# Altium schematic sheet 01_COVER.SchDoc: Enterprise Baseboard
size A2; ApprovedBy: DNP; CheckedBy: DNP; Author: DNP; CompanyName: Google LLC; DrawnBy: DNP; Engineer: Bangfei/Michael/Leo; Organization: Google LLC; Address1: 1600 Amphitheatre Parkway; Address2: Mountain View, CA 94043; Address3: DNP; Address4: DNP; DocumentNumber: DNP; Revision: PVT; SheetNumber: 1; SheetTotal: 11; VersionControl_RevNumber: DNP; IsUserConfigurable: DNP; Time: DNP; ImagePath: DNP; Rule: DNP; ProjectName: Enterprise; Application_BuildNumber: DNP
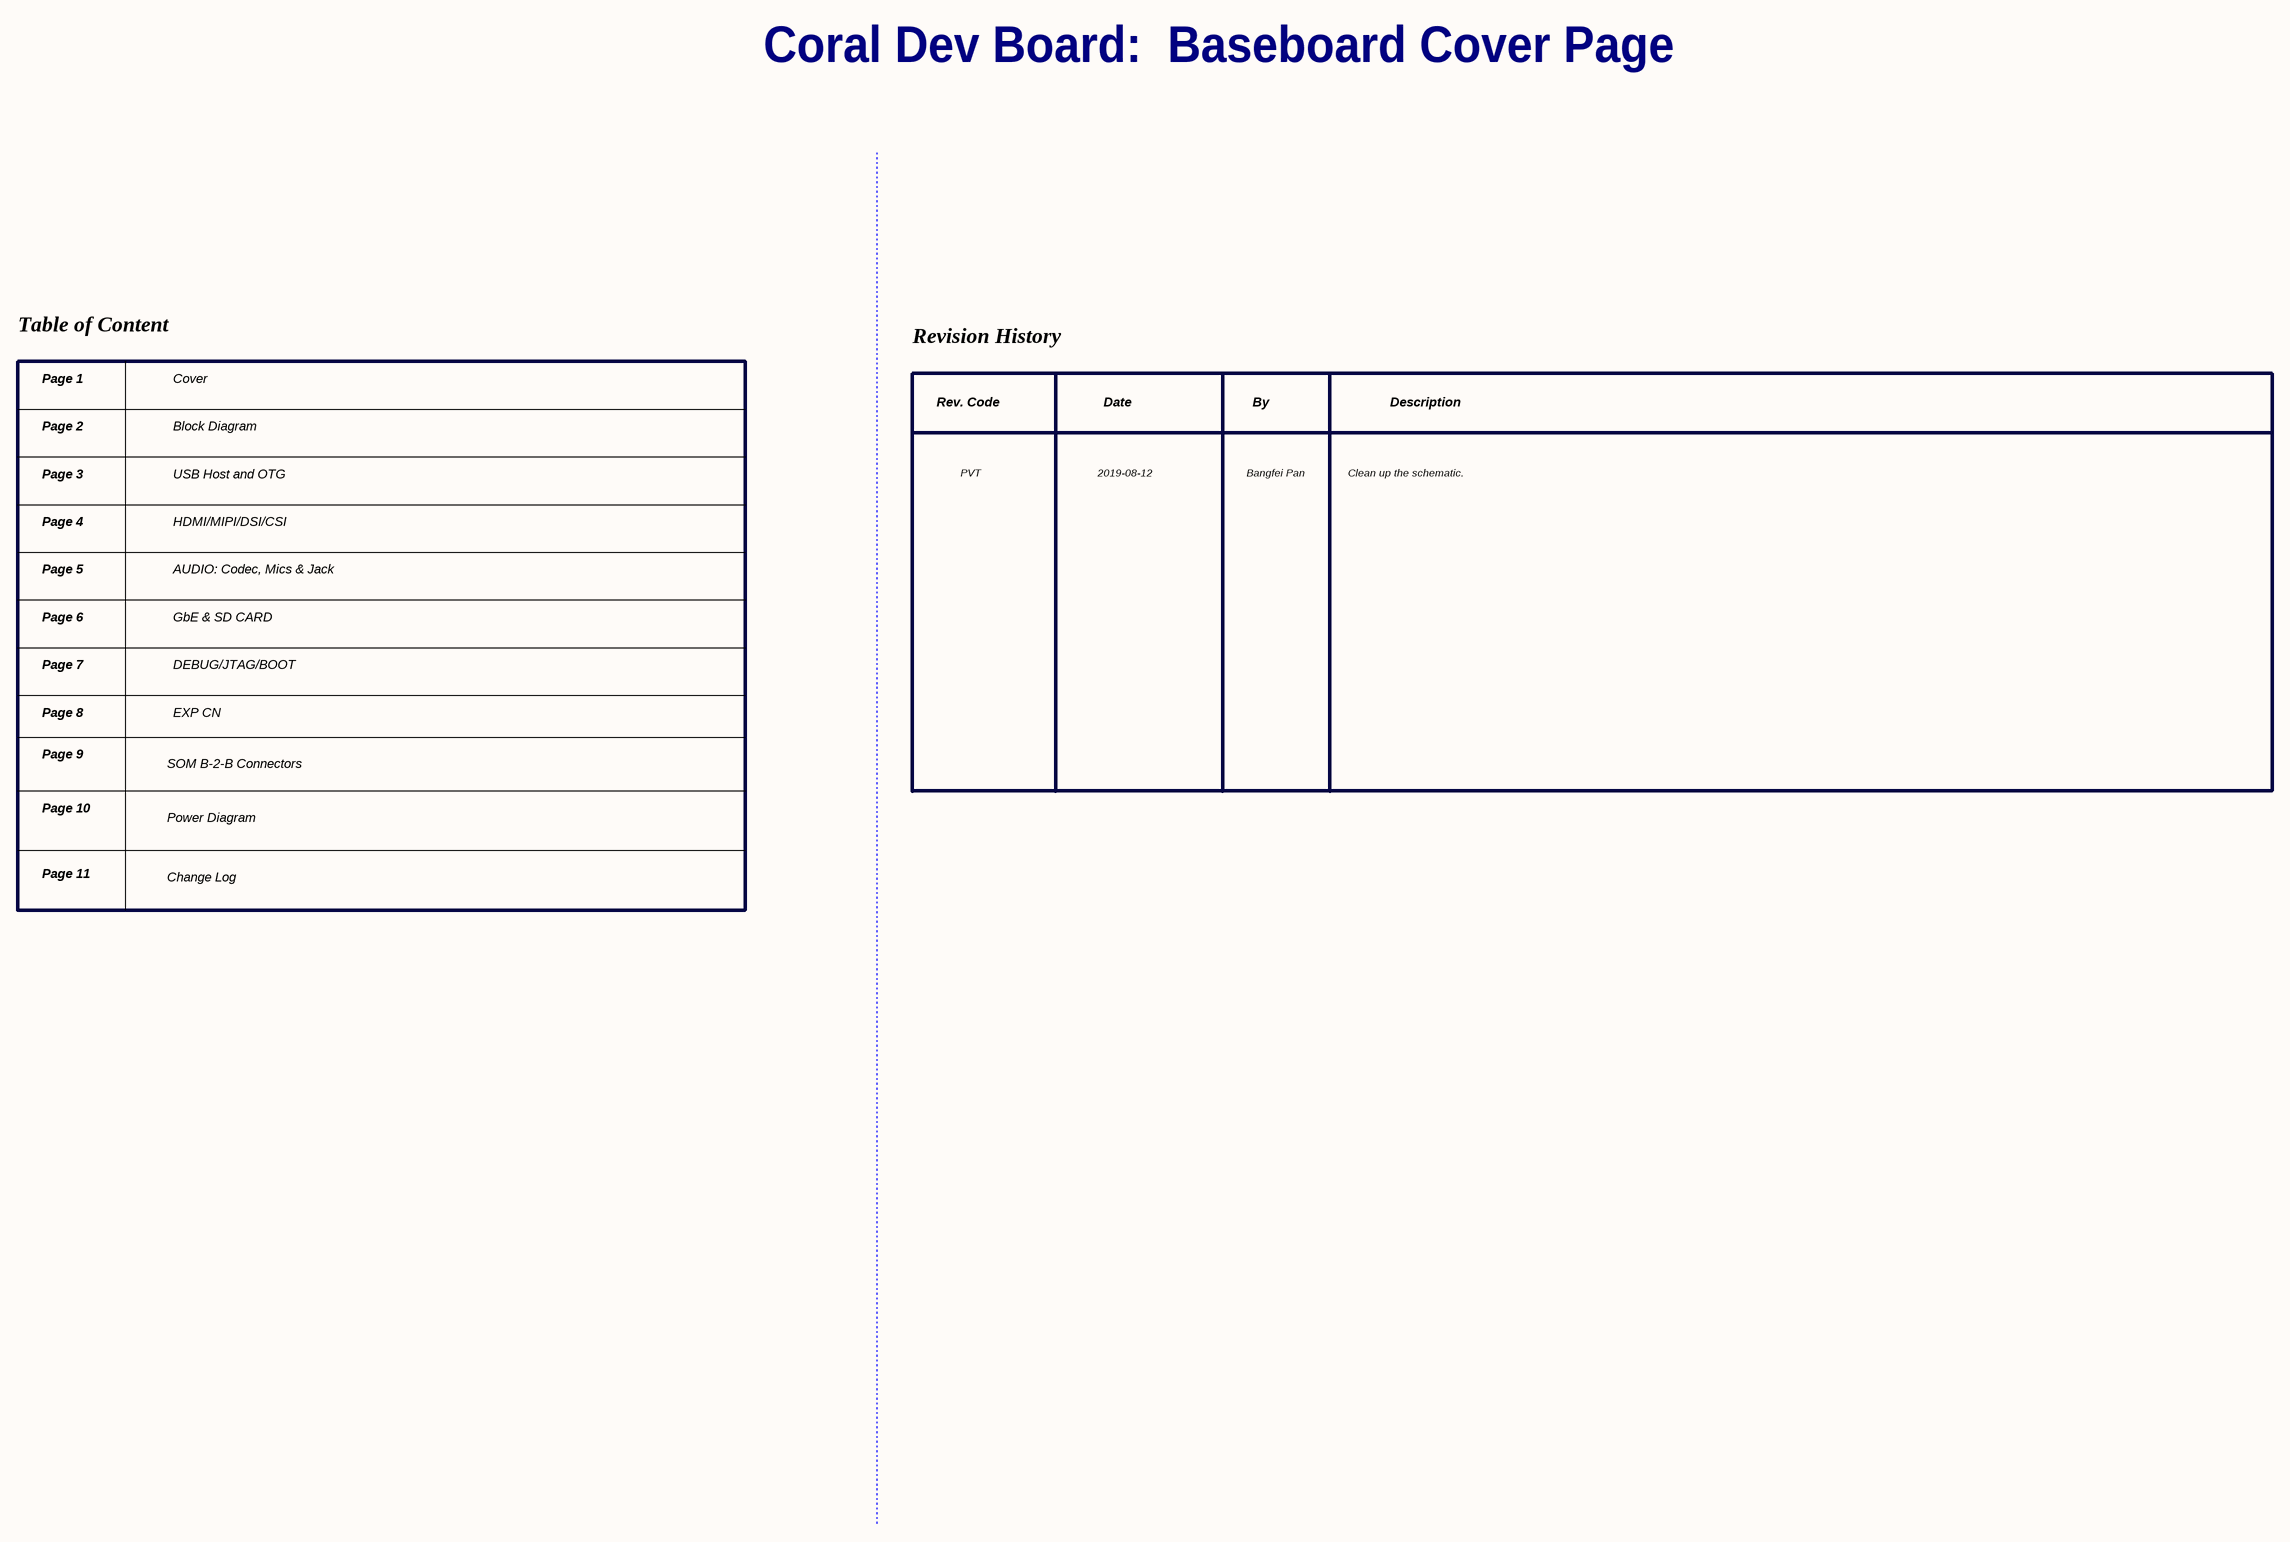
[diagram p0: 01_COVER.SchDoc]

## Notes on the sheet
- Coral Dev Board:  Baseboard Cover Page
- Table of Content
- Revision History
- Page 1
- Cover
- Rev. Code
- Date
- By
- Description
- Page 2
- Block Diagram
- Page 3
- Page 4
- USB Host and OTG
- HDMI/MIPI/DSI/CSI
- PVT
- 2019-08-12
- Bangfei Pan
- Clean up the schematic.
- Page 5
- AUDIO: Codec, Mics & Jack
- Page 6
- GbE & SD CARD
- Page 7
- DEBUG/JTAG/BOOT
- Page 8
- Page 9
- SOM B-2-B Connectors
- EXP CN
- Page 10
- Power Diagram
- Page 11
- Change Log
- Project:
- Engineer:
- Date:
- File:
- Revision:
- Sheet
- of